# EAGLE design MLX90393_breakout1_long (EAGLE 6.5.0)
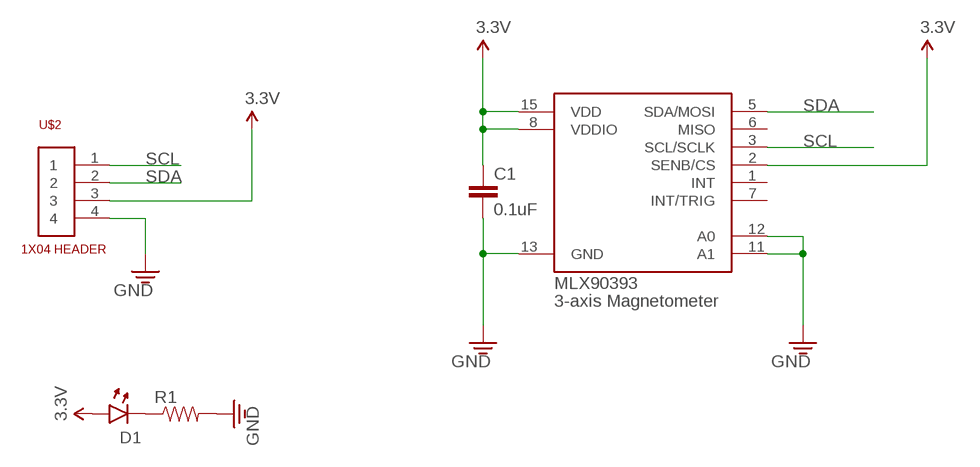
[diagram p0: schematic, sheet 1]

## Parts
C1  0.1uF  CAP0603  [0603]
D1  0605-LED  [0603-LED]
R1  RESISTOR0603  [0603]
U$1  MLX90393  [16-QFN]
U$2  1X04  [1X04]

## Nets
3.3V: C1.1 D1.ANODE U$1.2(SENB/CS) U$1.8(VDDIO) U$1.15(VDD) U$2.3
GND: C1.2 R1.2 U$1.11(A1) U$1.12(A0) U$1.13(GND) U$2.4
N$1: D1.CATHODE R1.1
SCL: U$1.3(SCL/SCLK) U$2.1
SDA: U$1.5(SDA/MOSI) U$2.2
Unconnected: U$1.1(INT) U$1.6(MISO) U$1.7(INT/TRIG)

## Library data of the parts
C1 = lowfieldmri:CAP: Capacitor Standard 0603 ceramic capacitor, and 0.1" leaded capacitor.
D1 = arducorder-mini:0605-LED
R1 = lowfieldmri:RESISTOR: Resistor Basic schematic elements and footprints for 0603, 1206, and PTH 1/10th watt (small) resistors.
U$1 = lowfieldmri:MLX90393: Melexis MLX90393 3-axis magnetometer
U$2 = lowfieldmri:1X04

## Board
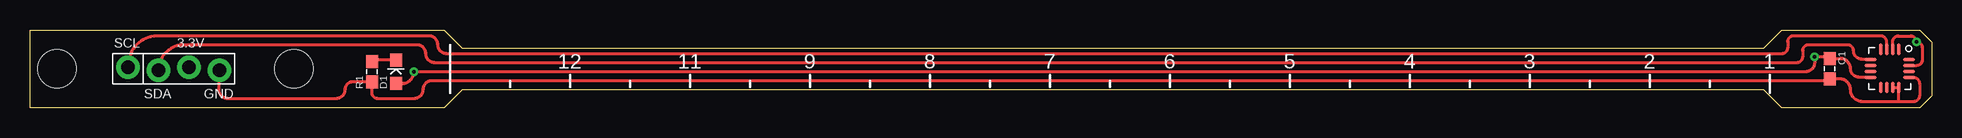
[diagram p1: board, top side]
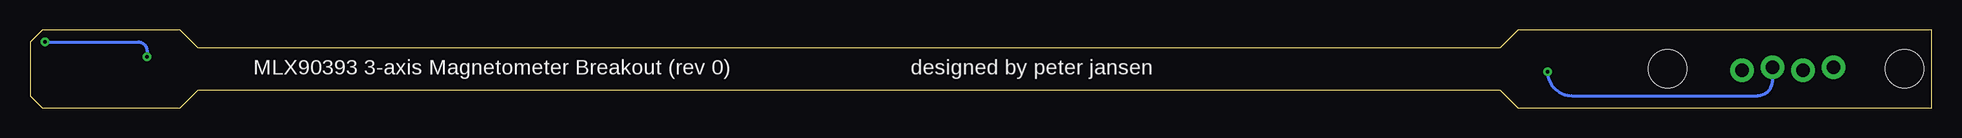
[diagram p2: board, bottom side, seen from below]

Size 158.5 x 6.5 mm. Coordinates in mm from the lower left corner, seen from the top.
Outline: 0,6.5 34.5,6.5 36,5 144.5,5 146,6.5 157.5,6.5 158.5,5.5 158.5,1 157.5,0 146,0 144.5,1.5 36,1.5 34.5,0 0,0 0,6.5
Copper layers (1*16): Top 0.035mm / dielectric 1.5mm / Bottom 0.035mm
Design rules "default": minimum track width 10mil, minimum drill 24mil, track to track 8mil, track to pad 8mil, pad to pad 8mil, via to via 8mil, smd to smd 8mil, copper to edge 40mil, drill to drill 8mil, minimum pad ring 10mil, minimum via ring 8mil, stop-mask expansion 4mil, vias tented up to drill 0mil, thermal gap 10mil
Holes 3.2 mm at 2.25,3.25 22,3.25

### Footprints (pad centres in the part's own frame; a part is rotated, then mirrored left to right if it is on the bottom)
0603 = smd 1.1 x 1: 1 -0.85,0; 2 0.85,0
0603-LED = smd 1.1 x 1: ANODE -0.975,0; CATHODE 0.975,0
16-QFN = smd 0.3 x 1: 1 0.75,1.6; 2 0.25,1.6; 3 -0.25,1.6; 4 -0.75,1.6; 9 -0.75,-1.6; 10 -0.25,-1.6; 11 0.25,-1.6; 12 0.75,-1.6 | smd 1 x 0.3: 5 -1.6,0.75; 6 -1.6,0.25; 7 -1.6,-0.25; 8 -1.6,-0.75; 13 1.6,-0.75; 14 1.6,-0.25; 15 1.6,0.25; 16 1.6,0.75
1X04 = drill 1.1 pad 1.93: 1 -5.08,0.127; 2 -2.54,-0.127; 3 0,0.127; 4 2.54,-0.127

### Placement (x,y rotation side)
C1  150,3.25 270 top
D1  30.5,3 90 top
R1  28.5,3 270 top
U$1  155.01,3.29 0 top
U$2  13.25,3.25 0 top

### Tracks (layer width: path | path; a pad name or v marks a point on that pad's centre or on a via)
3.3V  (via drill 0.33)
  Top 0.254: U$1.8 152.46,2.54 arc-90 151.75,3.25 arc90 150.9,4.1 C1.1 | U$1.2 155.26,5.51 arc-90 155.75,6 156.75,6 arc-90 v157.25,5.5 arc-90 157.75,5 157.75,4 arc-90 157.29,3.54 U$1.15 | 150,4.25 C1.1 | C1.1 149.85,4.25 v148.75,4.25 148.75,3.75 arc-90 148,3 v32,3 arc-90 31.02,2.03 D1.ANODE
  Bottom 0.254: v157.25,5.5 149.5,5.5 arc90 148.75,4.75 v148.75,4.25 | v32,3 arc-90 30,1 14.5,1 arc-90 13.25,2.25 U$2.3
GND
  Top 0.254: U$1.13 156.96,2.54 arc-90 157.5,2 157.5,1 arc-90 157,0.5 155.76,0.5 | 155.76,0.5 152.75,0.5 arc-90 151.75,1.5 arc90 150.85,2.4 C1.2 150,2.25 33.5,2.25 arc90 32.75,1.5 arc-90 32,0.75 29,0.75 arc-90 28.5,1.25 R1.2 26.9,2.15 arc90 26.25,1.5 arc-90 25.5,0.75 16.5,0.75 arc-90 15.75,1.5 15.75,3.08 arc-90 U$2.4 | U$1.11 U$1.12 155.76,0.5
N$1
  Top 0.254: D1.CATHODE 28.38,3.97 arc90 R1.1
SCL
  Top 0.254: U$1.3 154.76,5.49 arc90 154.25,6 147,6 arc90 146.5,5.5 146.5,5 arc-90 146,4.5 34.75,4.5 arc-90 34,5.25 arc90 33.25,6 10.54,6 arc90 U$2.1
SDA
  Top 0.254: U$1.5 152.71,4.04 arc-90 152,4.75 arc90 151.5,5.25 148.25,5.25 arc90 147.75,4.75 147.75,4.25 arc-90 147.25,3.75 33.75,3.75 arc-90 33,4.5 arc90 32.25,5.25 12.84,5.25 arc90 U$2.2

### Text on the board
tPlace: SCL | 3.3V | 12 | 11 | 9 | 8 | 7 | 6 | 5 | 4 | 3 | 2 | 1 | SDA | GND
bPlace: designed by peter jansen | MLX90393 3-axis Magnetometer Breakout (rev 0)